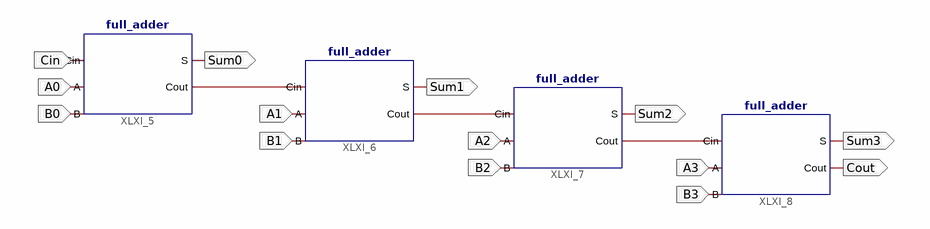
[diagram p0: schematic sheet 1]
// Xilinx ISE schematic four_bit_full_adder.sch (spartan3) as structural Verilog: 4 symbols, 14 ports
module four_bit_full_adder (
  input  Cin,
  input  A0,
  input  B0,
  input  A1,
  input  B1,
  input  A2,
  input  B2,
  input  A3,
  input  B3,
  output Sum0,
  output Sum1,
  output Sum2,
  output Sum3,
  output Cout
);

  wire XLXN_153, XLXN_155, XLXN_158;

  full_adder XLXI_5 (.Cin(Cin), .A(A0), .B(B0), .S(Sum0), .Cout(XLXN_153));
  full_adder XLXI_6 (.Cin(XLXN_153), .A(A1), .B(B1), .S(Sum1), .Cout(XLXN_155));
  full_adder XLXI_7 (.Cin(XLXN_155), .A(A2), .B(B2), .S(Sum2), .Cout(XLXN_158));
  full_adder XLXI_8 (.Cin(XLXN_158), .A(A3), .B(B3), .S(Sum3), .Cout(Cout));
endmodule
